# EAGLE schematic MM_Main_old (EAGLE 7.1.0)
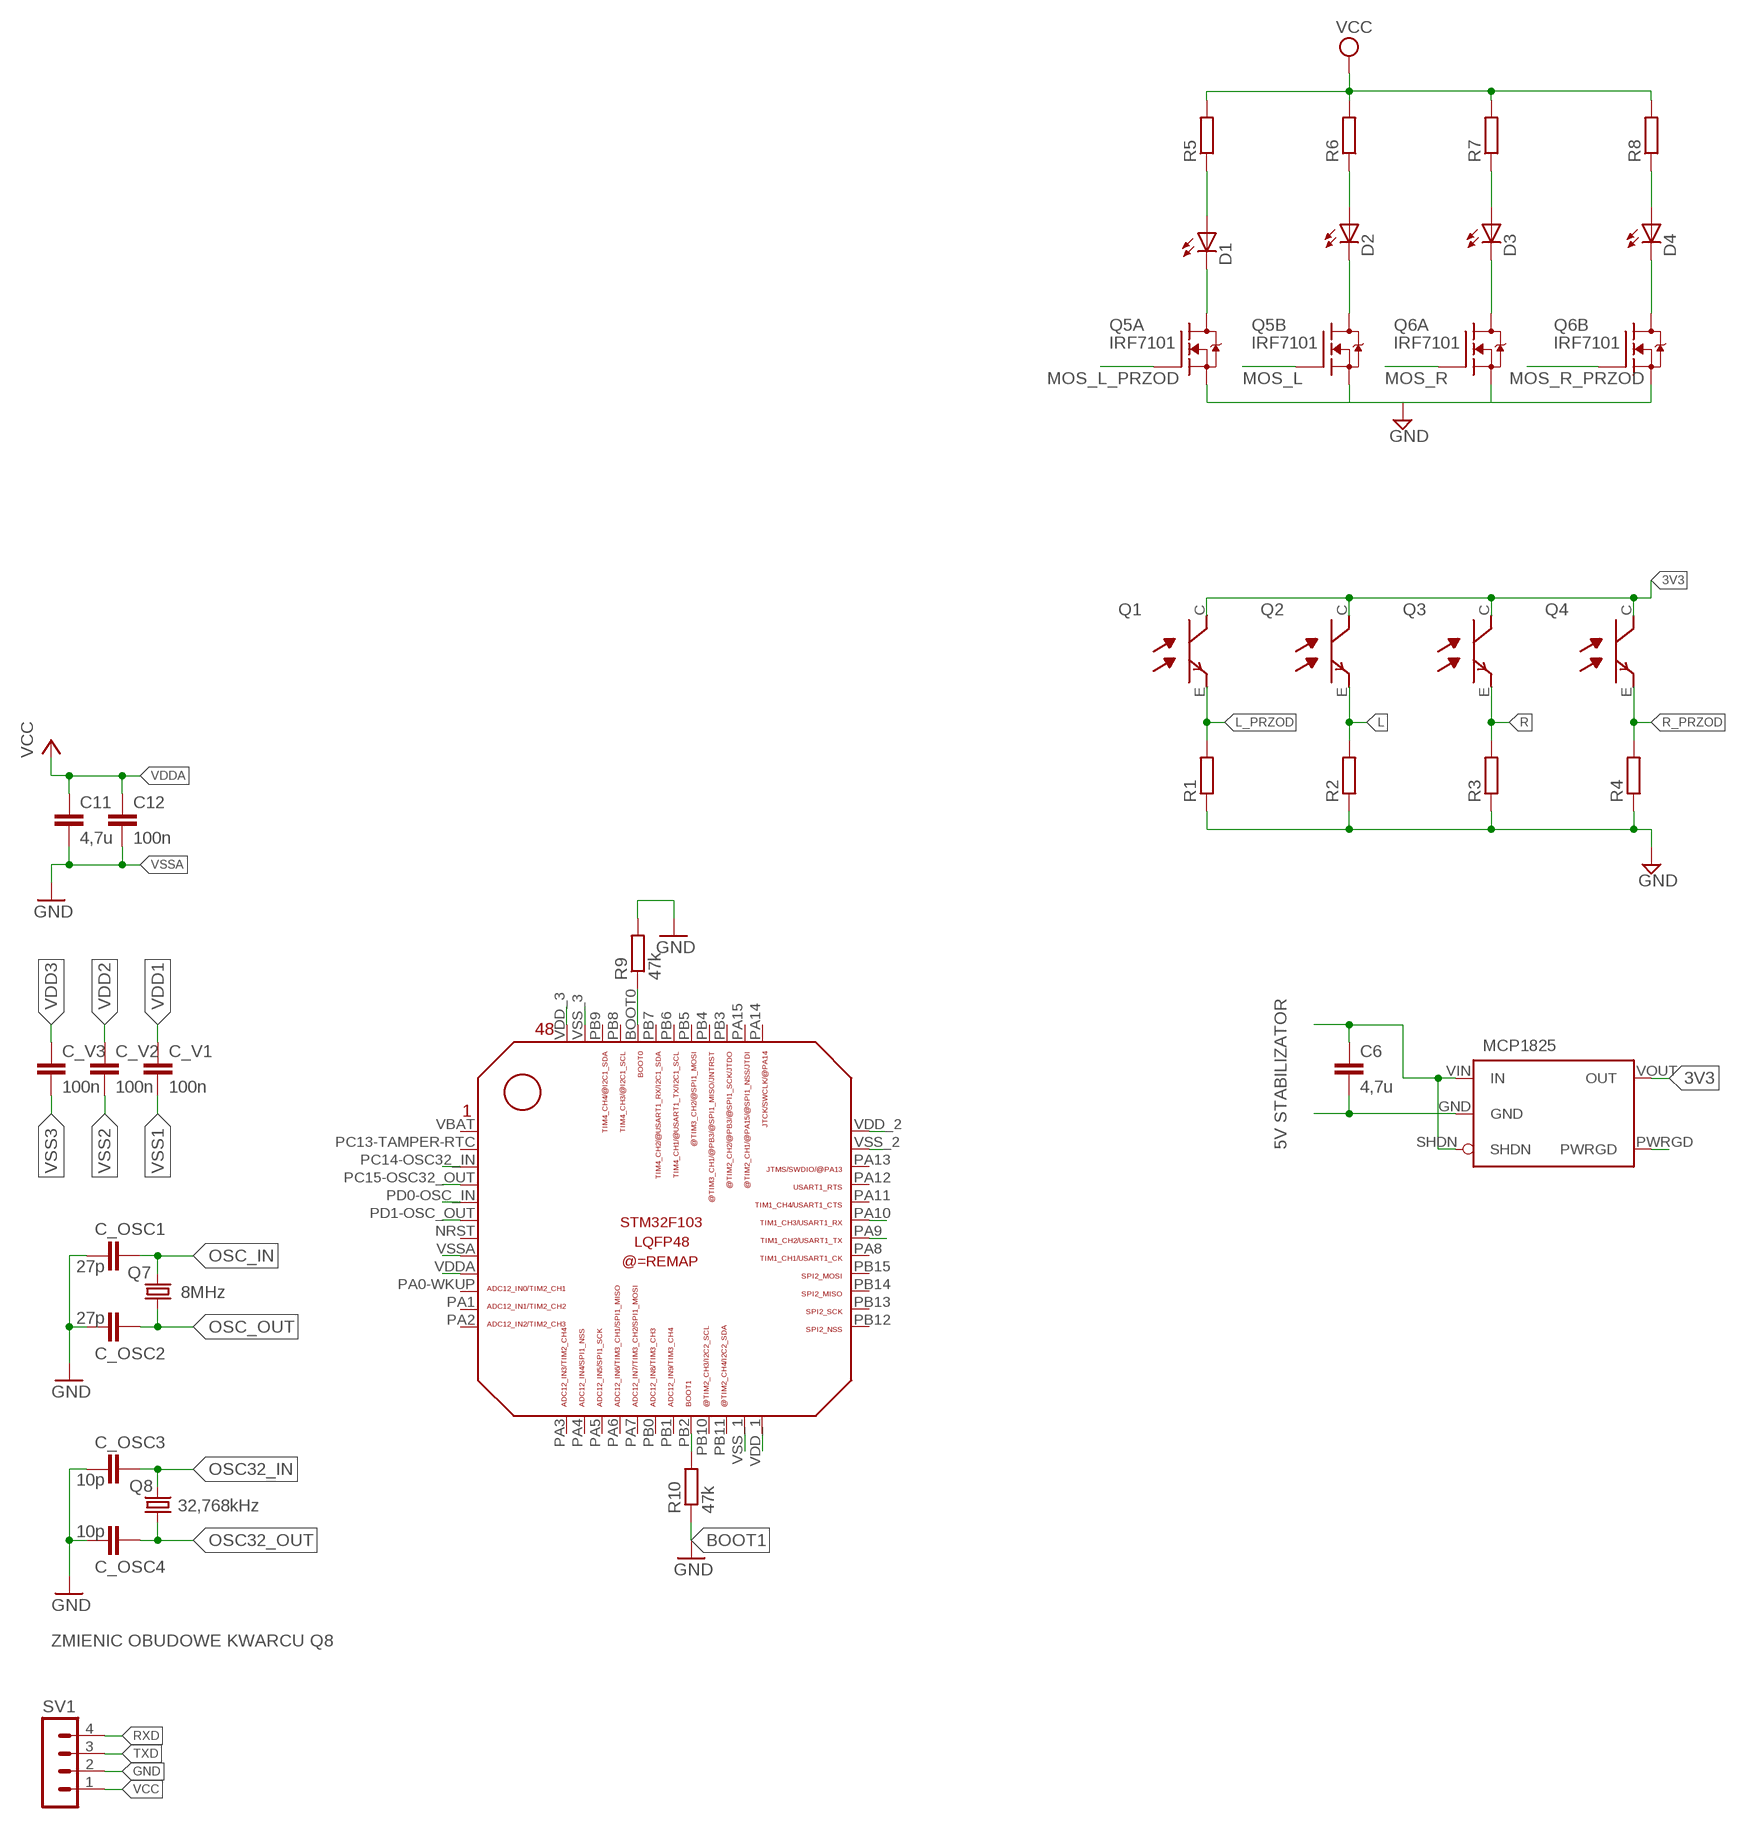
[diagram p0: schematic, sheet 1, part 1 of 2]
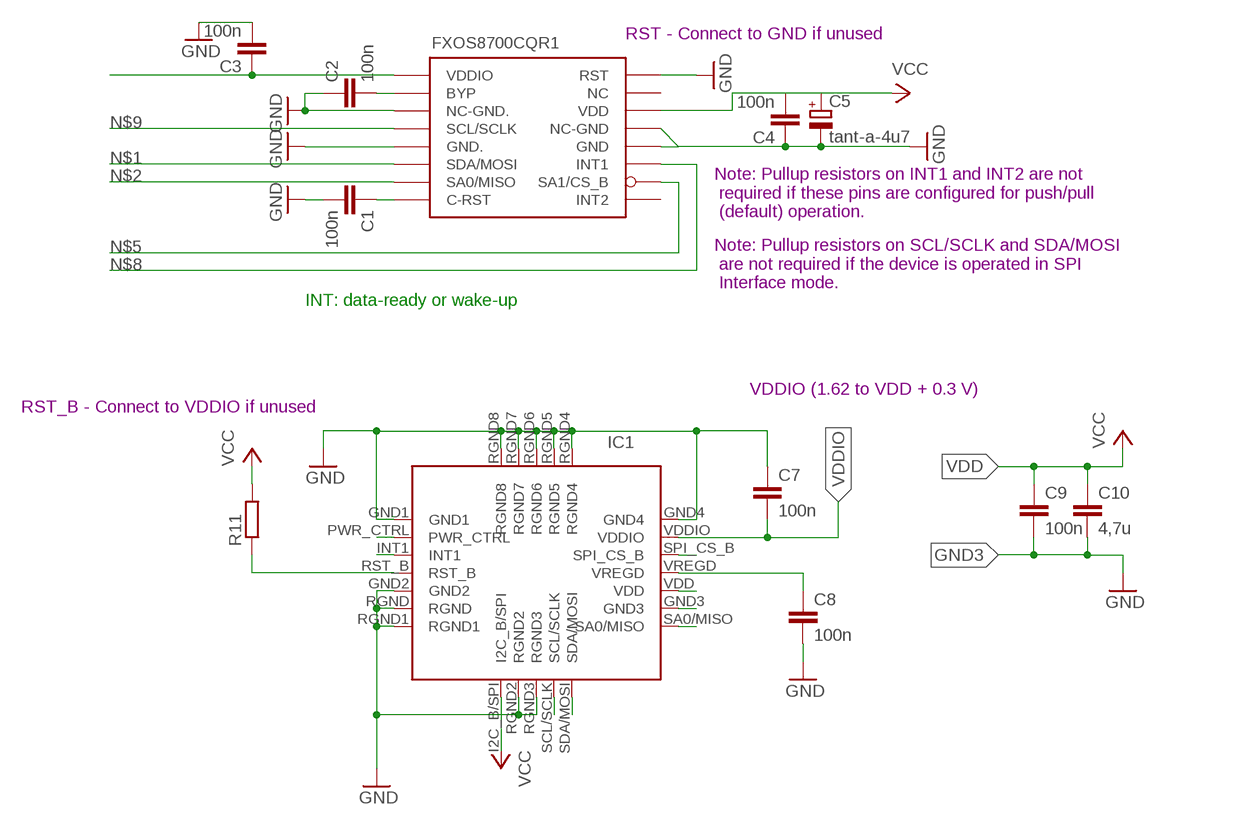
[diagram p1: schematic, sheet 1, part 2 of 2]

## Parts
C1  100n  C-EUC0603  [C0603]
C2  100n  C-EUC0603  [C0603]
C3  100n  C-EUC0603  [C0603]
C4  100n  C-EUC0603  [C0603]
C5  tant-a-4u7  CPOL-EUSMCA  [SMC_A]
C6  4,7u  C-EUC3216  [C3216]
C7  100n  C-EUC0603  [C0603]
C8  100n  C-EUC0603  [C0603]
C9  100n  C-EUC0603  [C0603]
C10  4,7u  C-EUC3216  [C3216]
C11  4,7u  C-EUC3216  [C3216]
C12  100n  C-EUC0805  [C0805]
C_OSC1  27p  C-EUC0805  [C0805]
C_OSC2  27p  C-EUC0805  [C0805]
C_OSC3  10p  C-EUC0805  [C0805]
C_OSC4  10p  C-EUC0805  [C0805]
C_V1  100n  C-EUC0805  [C0805]
C_V2  100n  C-EUC0805  [C0805]
C_V3  100n  C-EUC0805  [C0805]
D1  SFH4545  [SFH4545]
D2  SFH4545  [SFH4545]
D3  SFH4545  [SFH4545]
D4  SFH4545  [SFH4545]
IC1  FXAS21002C  [QFN24-4X4]
Q1  TEFT4300  [TEFT4300]
Q2  TEFT4300  [TEFT4300]
Q3  TEFT4300  [TEFT4300]
Q4  TEFT4300  [TEFT4300]
Q5  IRF7101  [SO8]
Q6  IRF7101  [SO8]
Q7  8MHz  CRYSTALHC49U70  [HC49U70]
Q8  32,768kHz  CRYSTALHC49U70  [HC49U70]
R1  R-EU_R0805  [R0805]
R2  R-EU_R0805  [R0805]
R3  R-EU_R0805  [R0805]
R4  R-EU_R0805  [R0805]
R5  R-EU_R0805  [R0805]
R6  R-EU_R0805  [R0805]
R7  R-EU_R0805  [R0805]
R8  R-EU_R0805  [R0805]
R9  47k  R-EU_R0805  [R0805]
R10  47k  R-EU_R0805  [R0805]
R11  R-EU_R0805  [R0805]
SV1  MA04-1  [MA04-1]
U$1  STM32F103_LQFP48  [STM32F103_LQFP48]
U$2  FXOS8700CQR1  [QFN16-5X3]
U$3  MCP1825  [SOT223-5]

## Nets
3V3: Q1.C Q2.C Q3.C Q4.C U$3.VOUT(OUT)
5V: C6.1 U$3.SHDN U$3.VIN(IN)
BOOT1: R10.1 ; supply symbol labelled GND
GND: C1.2 C2.1 C3.2 C4.1 C5.- C7.1 C8.2 C_OSC1.1 C_OSC2.1 C_OSC3.1 C_OSC4.1 IC1.GND1 IC1.GND2 IC1.GND4 IC1.RGND IC1.RGND1 IC1.RGND2 IC1.RGND3 IC1.RGND4 IC1.RGND5 IC1.RGND6 IC1.RGND7 IC1.RGND8 Q5.1(A:S) Q5.3(B:S) Q6.1(A:S) Q6.3(B:S) R1.1 R2.1 R3.1 R4.1 R9.2 SV1.2 U$2.P$3(NC-GND.) U$2.P$5(GND.) U$2.P$12(GND) U$2.P$13(NC-GND) U$2.P$16(RST)
GND3: C9.2 C10.2 IC1.GND3 ; supply symbol labelled GND
L: Q2.E R2.2
L_PRZOD: Q1.E R1.2
MOS_L: Q5.4(B:G)
MOS_L_PRZOD: Q5.2(A:G)
MOS_R: Q6.2(A:G)
MOS_R_PRZOD: Q6.4(B:G)
N$1: U$2.P$6(SDA/MOSI)
N$2: U$2.P$7(SA0/MISO)
N$3: C3.1 U$2.P$1(VDDIO)
N$4: R9.1 U$1.BOOT0
N$5: U$2.P$10(SA1/CS_B)
N$6: C1.1 U$2.P$8(C-RST)
N$7: C2.2 U$2.P$2(BYP)
N$8: U$2.P$11(INT1)
N$9: U$2.P$4(SCL/SCLK)
N$10: C6.2 U$3.GND
N$11: D1.-(C) Q5.7(A:D) Q5.8(A:D)
N$12: D2.-(C) Q5.5(B:D) Q5.6(B:D)
N$13: R10.2 U$1.PB2
N$14: U$3.PWRGD
N$15: IC1.SDA/MOSI
N$16: IC1.SCL/SCLK
N$17: IC1.SA0/MISO
N$18: U$1.PA10
N$19: IC1.SPI_CS_B
N$20: C8.1 IC1.VREGD
N$21: IC1.PWR_CTRL
N$22: IC1.INT1
N$23: IC1.RST_B R11.1
N$24: U$1.PA9
N$25: D3.-(C) Q6.7(A:D) Q6.8(A:D)
N$26: D4.-(C) Q6.5(B:D) Q6.6(B:D)
N$27: D4.+(A) R8.1
N$28: D3.+(A) R7.1
N$29: D2.+(A) R6.1
N$30: D1.+(A) R5.1
OSC32_IN: C_OSC3.2 Q8.2 U$1.PC14-OSC32_IN
OSC32_OUT: C_OSC4.2 Q8.1 U$1.PC15-OSC32_OUT(PC15-OSC_OUT)
OSC_IN: C_OSC1.2 Q7.2 U$1.PD0-OSC_IN
OSC_OUT: C_OSC2.2 Q7.1 U$1.PD1-OSC_OUT
R: Q3.E R3.2
R_PRZOD: Q4.E R4.2
RXD: SV1.4
TXD: SV1.3
VCC: C4.2 C5.+ IC1.I2C_B/SPI R5.2 R6.2 R7.2 R8.2 R11.2 SV1.1 U$2.P$14(VDD)
VDD: C9.1 C10.1 IC1.VDD ; supply symbol labelled VCC
VDD1: C_V1.1 U$1.VDD_1
VDD2: C_V2.1 U$1.VDD_2
VDD3: C_V3.1 U$1.VDD_3
VDDA: C11.1 C12.1 U$1.VDDA ; supply symbol labelled VCC
VDDIO: C7.2 IC1.VDDIO
VSS1: C_V1.2 U$1.VSS_1
VSS2: C_V2.2 U$1.VSS_2
VSS3: C_V3.2 U$1.VSS_3
VSSA: C11.2 C12.2 U$1.VSSA ; supply symbol labelled GND
Unconnected: U$1.NRST U$1.PA0-WKUP U$1.PA1 U$1.PA2 U$1.PA3 U$1.PA4 U$1.PA5 U$1.PA6 U$1.PA7 U$1.PA8 U$1.PA11 U$1.PA12 U$1.PA13 U$1.PA14 U$1.PA15 U$1.PB0 U$1.PB1 U$1.PB3 U$1.PB4 U$1.PB5 U$1.PB6 U$1.PB7 U$1.PB8 U$1.PB9 U$1.PB10 U$1.PB11 U$1.PB12 U$1.PB13 U$1.PB14 U$1.PB15 U$1.PC13-TAMPER-RTC U$1.VBAT U$2.P$9(INT2) U$2.P$15(NC)

## Notes on the sheet
- RST - Connect to GND if unused
- Note: Pullup resistors on INT1 and INT2 are not
   required if these pins are configured for push/pull
   (default) operation.
- Note: Pullup resistors on SCL/SCLK and SDA/MOSI
   are not required if the device is operated in SPI
   Interface mode.
- INT: data-ready or wake-up
- VDDIO (1.62 to VDD + 0.3 V)
- RST_B - Connect to VDDIO if unused
- 5V STABILIZATOR
- ZMIENIC OBUDOWE KWARCU Q8

## Library data of the parts
C1-C4 C6-C12 C_OSC1-C_OSC4 C_V1-C_V3 = rcl:C-EU: CAPACITOR, European symbol
C5 = rcl:CPOL-EU: POLARIZED CAPACITOR, European symbol
D1-D4 = _microMouse:SFH4545
IC1 = _microMouse:FXAS21002C
Q1-Q4 = _MM:TEFT4300
Q5 Q6 = _microMouse:IRF7101
Q7 Q8 = crystal:CRYSTAL: CRYSTAL; OC_FARNELL: unknown; OC_NEWARK: unknown
R1-R11 = rcl:R-EU_: RESISTOR, European symbol
SV1 = con-lstb:MA04-1: PIN HEADER; OC_FARNELL: unknown; OC_NEWARK: unknown
U$1 = STM32F10x F4xx:STM32F103_LQFP48
U$2 = _microMouse:FXOS8700CQ: 6D 6axis sensor - 3D accelerator and 3D magnetometer
U$3 = _microMouse:MCP1825